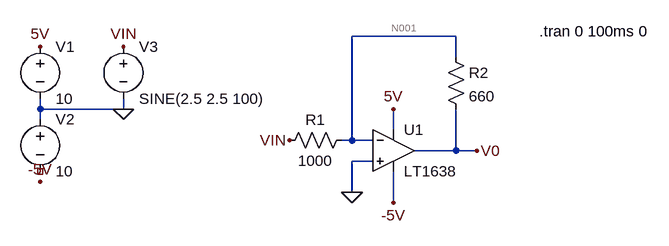
[diagram p0: schematic 5vto3vOpAmpCircuit.asc]
5vto3vOpAmpCircuit.asc, the LTspice schematic file:
Version 4
SHEET 1 880 680
WIRE 560 16 400 16
WIRE 560 48 560 16
WIRE -80 128 -80 112
WIRE 48 128 48 112
WIRE 48 128 -80 128
WIRE -80 144 -80 128
WIRE 464 160 464 128
WIRE 400 176 400 16
WIRE 400 176 384 176
WIRE 432 176 400 176
WIRE 560 192 560 128
WIRE 560 192 496 192
WIRE 592 192 560 192
WIRE 432 208 400 208
WIRE 400 256 400 208
WIRE 464 272 464 224
FLAG -80 32 5V
FLAG 48 32 VIN
FLAG -80 240 -5V
FLAG 464 272 -5V
FLAG 464 128 5V
FLAG 304 176 VIN
FLAG 592 192 V0
FLAG 48 128 0
FLAG 400 256 0
SYMBOL Opamps\\LT1638 464 128 R0
SYMATTR InstName U1
SYMBOL voltage -80 16 R0
WINDOW 123 0 0 Left 0
WINDOW 39 0 0 Left 0
SYMATTR InstName V1
SYMATTR Value 10
SYMBOL voltage -80 128 R0
WINDOW 123 0 0 Left 0
WINDOW 39 0 0 Left 0
SYMATTR InstName V2
SYMATTR Value 10
SYMBOL voltage 48 16 R0
WINDOW 123 0 0 Left 0
WINDOW 39 0 0 Left 0
SYMATTR InstName V3
SYMATTR Value SINE(2.5 2.5 100)
SYMBOL res 400 160 R90
WINDOW 0 0 56 VBottom 2
WINDOW 3 32 56 VTop 2
SYMATTR InstName R1
SYMATTR Value 1000
SYMBOL res 544 32 R0
SYMATTR InstName R2
SYMATTR Value 660
TEXT 688 8 Left 2 !.tran 0 100ms 0

The netlist it stands for:
* 5vto3vOpAmpCircuit.asc
XU1 0 N001 5V -5V V0 LT1638  ; pins In+ In- V+ V- OUT
V1 5V 0 10
V2 0 NC_01 10
V3 VIN 0 SINE(2.5 2.5 100)
R1 N001 VIN 1000
R2 N001 V0 660
.tran 0 100ms 0
.backanno
.end

* Results of the author's LTspice run, read from the files saved beside the schematic
* Operating Point, zero values left out:
*   V(5v) = 10 V
*   V(n001) = 2.009 V
*   V(-5v) = 1.663 V
*   V(v0) = 1.685 V
*   V(vin) = 2.5 V
*   I(R2) = 490.6 µA
*   I(R1) = -491.4 µA
*   I(V3) = -491.4 µA
*   I(V1) = -167.8 µA
*   Ix(u1:1) = -659.2 µA
*   Ix(u1:2) = 777.7 nA
*   Ix(u1:3) = 167.8 µA
*   Ix(u1:5) = 490.6 µA
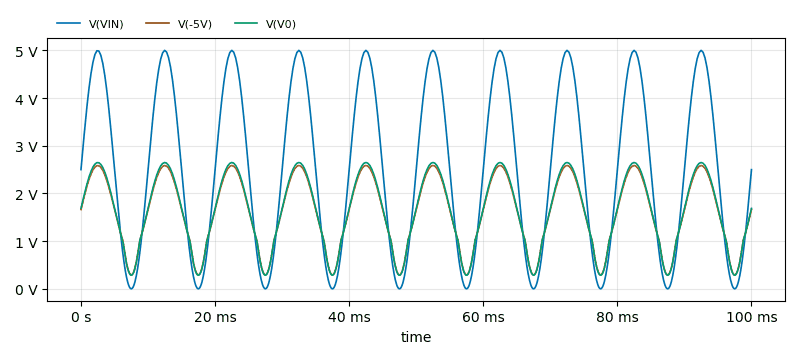
[diagram p1: Transient Analysis of 5vto3vOpAmpCircuit.asc, plotted from the saved traces]
* Transient Analysis, 1 run:
*   V(VIN): min 274.1 µV, max 5 V, average 2.498 V, rms 3.063 V, last 2.5 V
*   V(-5V): min 292.4 mV, max 2.585 V, average 1.589 V, rms 1.761 V, last 1.663 V
*   V(V0): min 285 mV, max 2.648 V, average 1.613 V, rms 1.794 V, last 1.685 V